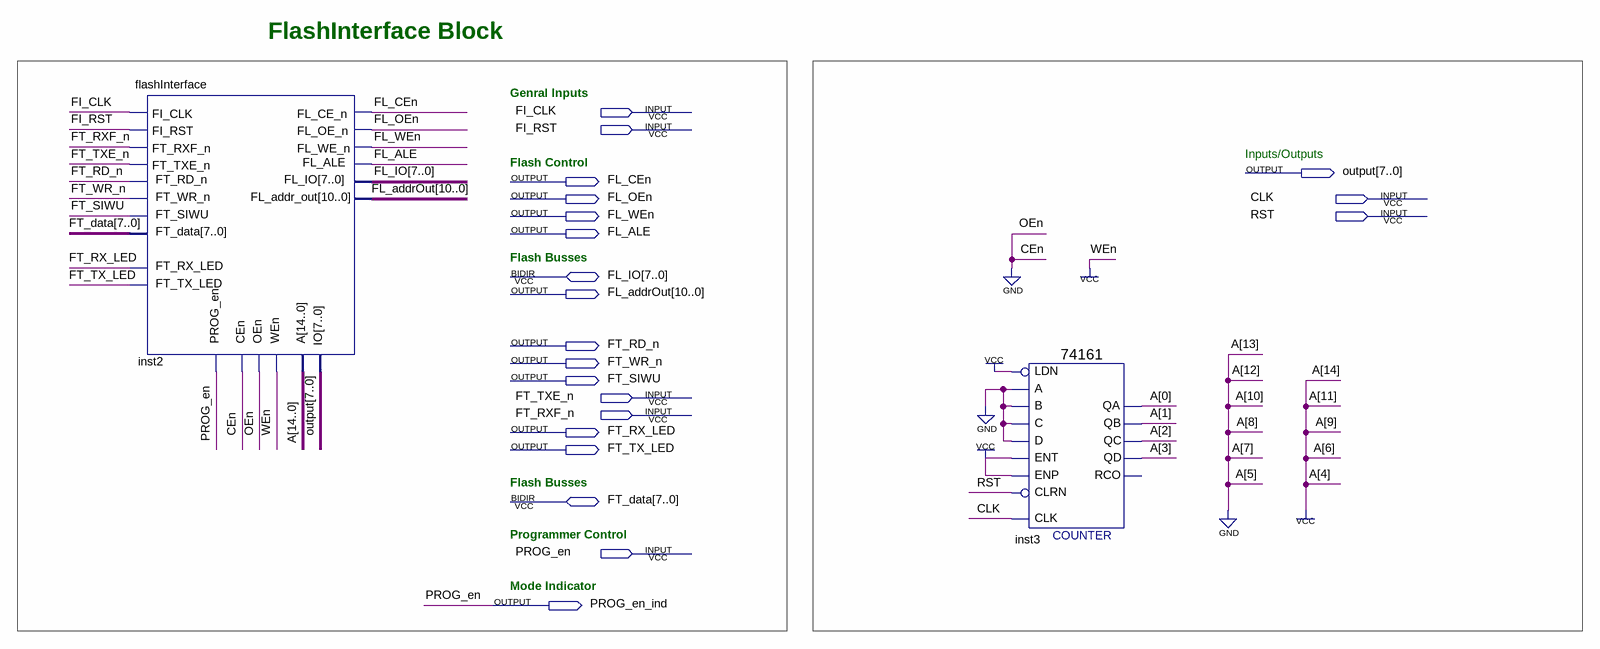
[diagram p0: schematic sheet]
// Quartus schematic flashInterface_TutProject.bdf as structural Verilog: 2 symbols, 21 pins
module flashInterface_TutProject (
  input  FI_CLK,
  input  FI_RST,
  input  CLK,
  input  RST,
  input  FT_TXE_n,
  input  FT_RXF_n,
  input  PROG_en,
  inout  [7:0] FL_IO,
  inout  [7:0] FT_data,
  output [7:0] \output ,
  output FL_CEn,
  output FL_OEn,
  output FL_WEn,
  output FL_ALE,
  output [10:0] FL_addrOut,
  output FT_RD_n,
  output FT_WR_n,
  output FT_SIWU,
  output FT_RX_LED,
  output FT_TX_LED,
  output PROG_en_ind
);

  wire [3:0] A;

  flashInterface inst2 (
    .FI_CLK(FI_CLK), .FI_RST(FI_RST), .FT_RXF_n(FT_RXF_n), .FT_TXE_n(FT_TXE_n), .PROG_en(PROG_en),
    .CEn(1'b0), .OEn(1'b0), .WEn(1'b1), .A({11'b10010100101, A}), .FT_RD_n(FT_RD_n), .FT_WR_n(FT_WR_n),
    .FT_SIWU(FT_SIWU), .FL_CE_n(FL_CEn), .FL_OE_n(FL_OEn), .FL_WE_n(FL_WEn), .FL_ALE(FL_ALE),
    .FT_RX_LED(FT_RX_LED), .FT_TX_LED(FT_TX_LED), .IO(\output ), .FL_addr_out(FL_addrOut), .FT_data(FT_data),
    .FL_IO(FL_IO));
  \74161  inst3 (
    .CLRN(RST), .CLK(CLK), .ENP(1'b1), .LDN(1'b1), .A(1'b0), .D(1'b0), .ENT(1'b1), .B(1'b0), .C(1'b0),
    .QD(A[3]), .QC(A[2]), .QB(A[1]), .QA(A[0]));  // open: RCO

  assign PROG_en_ind = PROG_en;

  // Notes on the sheet:
  //   FlashInterface Block   
  //   Genral Inputs
  //   Inputs/Outputs
  //   Flash Control
  //   Flash Busses
  //   Flash Busses
  //   Programmer Control
  //   Mode Indicator
endmodule
